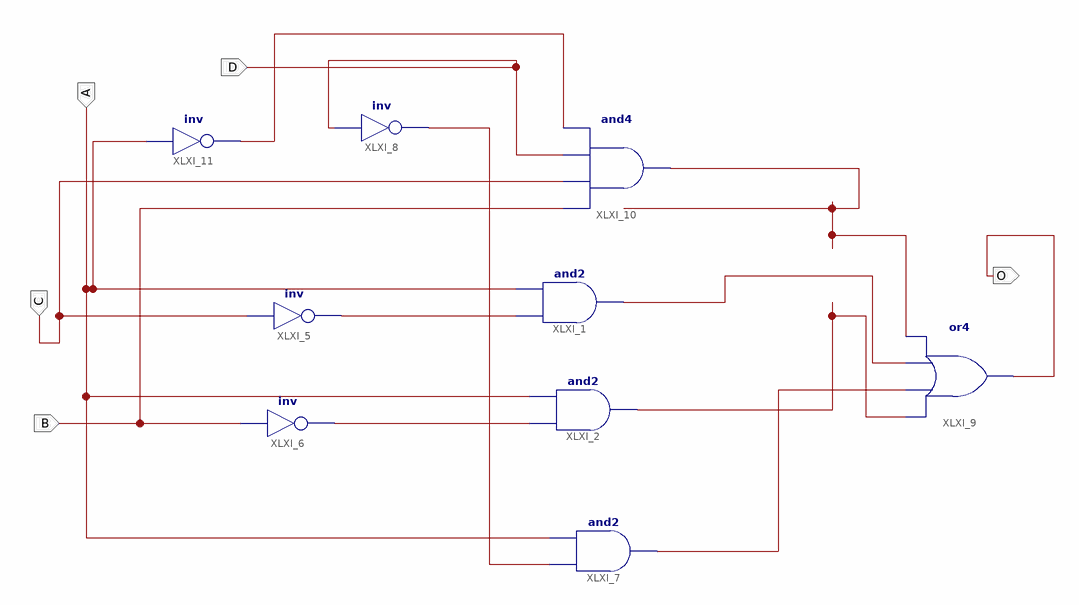
[diagram p0: schematic sheet 1]
// Xilinx ISE schematic lab7_A3.sch (spartan3e) as structural Verilog: 9 symbols, 5 ports
module lab7_A3 (
  input  A,
  input  C,
  input  B,
  input  D,
  output O
);

  wire XLXN_1, XLXN_2, XLXN_3, XLXN_5, XLXN_6, XLXN_18, XLXN_21, XLXN_27;

  and XLXI_1 (XLXN_2, XLXN_5, A);
  and XLXI_2 (XLXN_3, XLXN_6, A);
  not XLXI_5 (XLXN_5, C);
  not XLXI_6 (XLXN_6, B);
  and XLXI_7 (XLXN_21, XLXN_18, A);
  not XLXI_8 (XLXN_18, D);
  or XLXI_9 (O, XLXN_3, XLXN_21, XLXN_2, XLXN_1);
  and XLXI_10 (XLXN_1, B, C, D, XLXN_27);
  not XLXI_11 (XLXN_27, A);
endmodule
